# Altium schematic sheet OpenSwitch_Power.SchDoc
size A
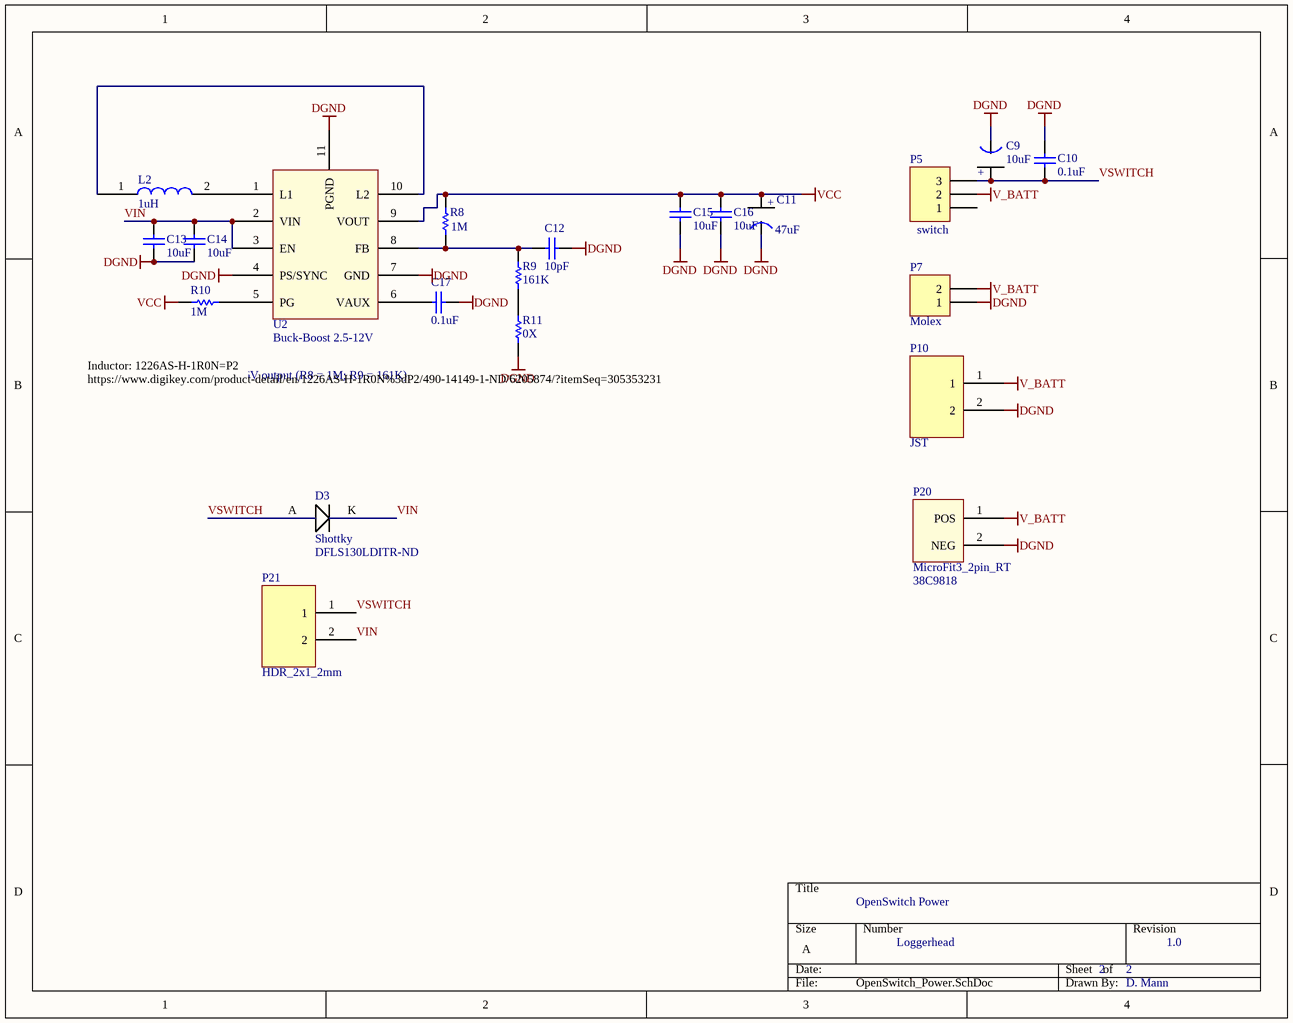
[diagram p0: OpenSwitch_Power.SchDoc]

## Parts
C9  10uF  [Tant0805]
C10  0.1uF  [0402]
C11  47uF  [Tant0805]
C12  10pF  [0402]
C13  10uF  [0603]
C14  10uF  [0603]
C15  10uF  [0603]
C16  10uF  [0603]
C17  0.1uF  [0402]
D3  Shottky  Supplier Part Number 1: DFLS130LDITR-ND  [DFLS130]
L2  1uH  [Inductor_NLV32T]
P5  switch  [HDR1X3]
P7  Molex  [HDR1X2]
P10  JST  [HDR_2x1_2mm]
P20  MicroFit3_2pin_RT  Supplier Part Number 1: 38C9818  [Microfit 3 - 2 pin RT]
P21  HDR_2x1_2mm  [HDR_2x1_2mm]
R8  1M  [3-0603]
R9  161K  [3-0603]
R10  1M  [3-0603]
R11  0X  [3-0603]
U2  Buck-Boost 2.5-12V  [TPS63060]

## Nets
DGND: C9.1(GND) C10.2 C11.1(GND) C12.2 C13.1 C14.1 C15.1 C16.1 C17.2 P7.1 P10.2 P20.2(NEG) R11.1 U2.4(PS/SYNC) U2.7(GND) U2.11(PGND)
V_BATT: P5.2 P7.2 P10.1 P20.1(POS)
VCC: C11.2(+) C15.2 C16.2 R8.2 R10.1 U2.9(VOUT)
VIN: C13.2 C14.2 D3.K P21.2 U2.2(VIN) U2.3(EN)
VSWITCH: C9.2(+) C10.1 D3.A P5.3 P21.1
NetC12_1: C12.1 R8.1 R9.2 U2.8(FB)
NetC17_1: C17.1 U2.6(VAUX)
NetL2_1: L2.1 U2.10(L2)
NetL2_2: L2.2 U2.1(L1)
NetR9_1: R9.1 R11.2
NetR10_2: R10.2 U2.5(PG)

Not connected (* = marked no-connect by the designer): P5 1

## Notes on the sheet
- 3.6V output (R8 = 1M; R9 = 161K)
- Inductor: 1226AS-H-1R0N=P2
  https://www.digikey.com/product-detail/en/1226AS-H-1R0N%3dP2/490-14149-1-ND/6205874/?itemSeq=305353231
- OpenSwitch Power
- Loggerhead
- 2
- 1.0
- D. Mann

## Library data of the parts
C9 = Tant0805: Value: 10uF
C10 C17 = C0402: Ceramic Chip Capacitor - Standard; Note: Footprint corresponds to dimensions for bulk cassette packaging. This case size has tightened tolerances.; Published: 17-Jul-2002; LatestRevisionDate: 19-Mar-2004; LatestRevisionNote: Silkscreen size reduced.; DatasheetDocument: Mar-2001; PackageDocument: Mar-2001; PackageReference: 0402; Publisher: Altium Limited; Code_JEITA: 0402; Code_IPC: 1005 [0402]; ComponentLink1Description: Manufacturer Link; ComponentLink1URL: http://www.kemet.com/; ComponentLink2Description: Datasheet; ComponentLink2URL: http://www.kemet.com/kemet/web/homepage/kechome.nsf/vapubfilesname/F3102TA.pdf/$file/F3102TA.pdf; Value: 0.1uF
C11 = Tant0805: Value: 10uF
C12 = C0402: Ceramic Chip Capacitor - Standard; Note: Footprint corresponds to dimensions for bulk cassette packaging. This case size has tightened tolerances.; Value: 0.1uF; Published: 17-Jul-2002; LatestRevisionDate: 19-Mar-2004; LatestRevisionNote: Silkscreen size reduced.; DatasheetDocument: Mar-2001; PackageDocument: Mar-2001; PackageReference: 0402; Publisher: Altium Limited; Code_JEITA: 0402; Code_IPC: 1005 [0402]; ComponentLink1Description: Manufacturer Link; ComponentLink1URL: http://www.kemet.com/; ComponentLink2Description: Datasheet; ComponentLink2URL: http://www.kemet.com/kemet/web/homepage/kechome.nsf/vapubfilesname/F3102TA.pdf/$file/F3102TA.pdf
C13-C16 = C0603: Ceramic Chip Capacitor - Standard; Note: Footprint corresponds to dimensions for bulk cassette packaging. This case size has tightened tolerances.; Published: 17-Jul-2002; LatestRevisionDate: 19-Mar-2004; LatestRevisionNote: Silkscreen size reduced.; DatasheetDocument: Mar-2001; PackageDocument: Mar-2001; PackageReference: 0603; Publisher: Altium Limited; Code_JEITA: 0603; Code_IPC: 1608 [0603]; ComponentLink1Description: Manufacturer Link; ComponentLink1URL: http://www.kemet.com/; ComponentLink2Description: Datasheet; ComponentLink2URL: http://www.kemet.com/kemet/web/homepage/kechome.nsf/vapubfilesname/F3102TA.pdf/$file/F3102TA.pdf
D3 = DFLS130: Supplier 1: Digi-Key
L2 = Inductor_NLV32T: Supplier 1: Mouser
P5 = Header 3: Header, 3-Pin; LatestRevisionDate: 17-Jul-2002; LatestRevisionNote: Re-released for DXP Platform.; Publisher: Altium Limited
P7 = Header 2: Header, 2-Pin; LatestRevisionDate: 17-Jul-2002; LatestRevisionNote: Re-released for DXP Platform.; Publisher: Altium Limited
P10 = HDR_2x1_2mm
R8-R11 = ERJ3RK: Precision Thick Film Chip Resistor, 10 Ohm to 1M Ohm Range, 1% and 0.5% Tolerance, 0603 Size, 0.063 W; Published: 17-Dec-2003; LatestRevisionDate: 19-Mar-2004; LatestRevisionNote: Silkscreen size reduced.; PackageDocument: Mar-2003; PackageReference: 3-0603; Publisher: Altium Limited; Code_IPC: 1608 [0603]; ComponentLink1Description: Manufacturer Link; ComponentLink1URL: http://www.panasonic.com/industrial/components/resistive_products.htm; ComponentLink2Description: Datasheet; ComponentLink2URL: http://www.panasonic.com/industrial/components/pdf/AOA0000CE2.pdf
U2 = TPS63060: Supplier 1: Newark; Supplier Part Number 1: 82T9733
P20 = MicroFit3_2pin_RT: Supplier 1: Newark